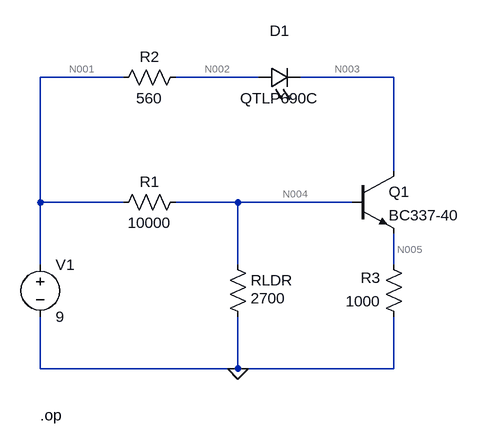
[diagram p0: schematic Circuit 6.asc]
Circuit 6.asc, the LTspice schematic file:
Version 4
SHEET 1 880 680
WIRE 48 -16 -80 -16
WIRE 256 -16 128 -16
WIRE 464 -16 320 -16
WIRE 464 128 464 -16
WIRE -80 176 -80 -16
WIRE 48 176 -80 176
WIRE 224 176 128 176
WIRE 400 176 224 176
WIRE -80 272 -80 176
WIRE 224 272 224 176
WIRE 464 272 464 224
WIRE -80 432 -80 352
WIRE 224 432 224 352
WIRE 224 432 -80 432
WIRE 464 432 464 352
WIRE 464 432 224 432
FLAG 224 432 0
SYMBOL res 144 160 R90
WINDOW 0 0 56 VBottom 2
WINDOW 3 32 56 VTop 2
SYMATTR InstName R1
SYMATTR Value 10000
SYMBOL res 144 -32 R90
WINDOW 0 0 56 VBottom 2
WINDOW 3 32 56 VTop 2
SYMATTR InstName R2
SYMATTR Value 560
SYMBOL res 480 368 R180
WINDOW 0 36 76 Left 2
WINDOW 3 36 40 Left 2
SYMATTR InstName R3
SYMATTR Value 1000
SYMBOL res 208 256 R0
WINDOW 3 36 68 Left 2
SYMATTR Value 2700
SYMATTR InstName RLDR
SYMBOL voltage -80 256 R0
SYMATTR InstName V1
SYMATTR Value 9
SYMBOL LED 256 0 R270
WINDOW 0 72 32 VTop 2
WINDOW 3 0 32 VBottom 2
SYMATTR InstName D1
SYMATTR Value QTLP690C
SYMBOL npn 400 128 R0
SYMATTR InstName Q1
SYMATTR Value BC337-40
TEXT -80 504 Left 2 !.op

The netlist it stands for:
* Circuit 6.asc
R1 N004 N001 10000
R2 N002 N001 560
R3 0 N005 1000
RLDR N004 0 2700
V1 N001 0 9
D1 N002 N003 QTLP690C
Q1 N003 N004 N005 0 BC337-40
.model D D
.lib standard.dio
.model NPN NPN
.model PNP PNP
.lib standard.bjt
.op
.backanno
.end

* Results of the author's LTspice run, read from the files saved beside the schematic
* Operating Point:
*   V(n004) = 1.907 V
*   V(n001) = 9 V
*   V(n002) = 8.272 V
*   V(n005) = 1.303 V
*   V(n003) = 6.557 V
*   Ic(Q1) = 1.3 mA
*   Ib(Q1) = 3.012 µA
*   Ie(Q1) = -1.303 mA
*   I(D1) = 1.3 mA
*   I(R1) = -709.3 µA
*   I(R2) = -1.3 mA
*   I(R3) = -1.303 mA
*   I(Rldr) = 706.3 µA
*   I(V1) = -2.009 mA
* From the log:
*   Semiconductor Device Operating Points:
*                           --- Diodes ---
*   Name:      d1
*   Model:  qtlp690c
*   Id:      1.30e-03
*   Vd:      1.72e+00
*   Req:     2.98e+01
*   CAP:     1.56e-10
*                           --- Bipolar Transistors ---
*   Name:       q1
*   Model:   bc337-40
*   Ib:       3.01e-06
*   Ic:       1.30e-03
*   Vbe:      6.04e-01
*   Vbc:     -4.65e+00
*   Vce:      5.25e+00
*   BetaDC:   4.32e+02
*   Gm:       5.05e-02
*   Rpi:      8.55e+03
*   Rx:       6.79e+01
*   Ro:       7.98e+04
*   Cbe:      1.05e-10
*   Cbc:      2.28e-12
*   Cjs:      0.00e+00
*   BetaAC:   4.32e+02
*   Cbx:      2.73e-12
*   Ft:       7.30e+07